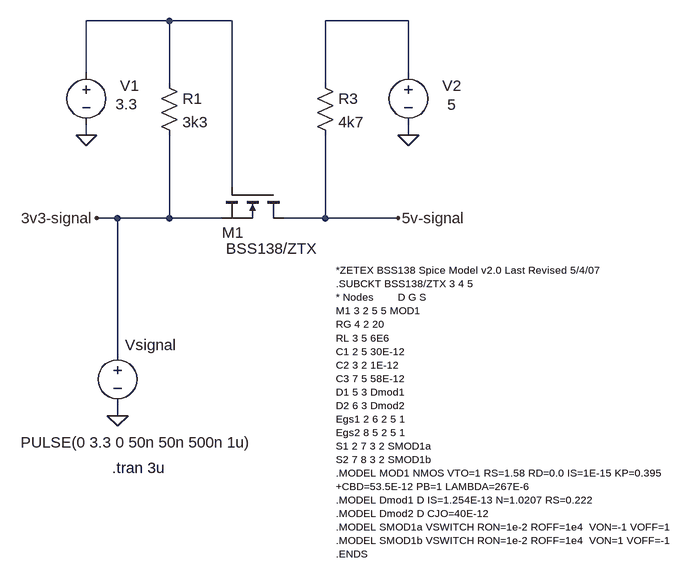
[diagram p0: schematic LTSPICE logic level shifter.asc]
LTSPICE logic level shifter.asc, the LTspice schematic file:
Version 4.1
SHEET 1 1396 740
WIRE 288 -96 160 -96
WIRE 384 -96 288 -96
WIRE 656 -96 528 -96
WIRE 160 -16 160 -96
WIRE 656 -16 656 -96
WIRE 288 0 288 -96
WIRE 528 0 528 -96
WIRE 160 80 160 64
WIRE 656 80 656 64
WIRE 384 160 384 -96
WIRE 208 208 176 208
WIRE 288 208 288 80
WIRE 288 208 208 208
WIRE 368 208 288 208
WIRE 528 208 528 80
WIRE 528 208 464 208
WIRE 640 208 528 208
WIRE 208 416 208 208
WIRE 208 512 208 496
FLAG 208 512 0
FLAG 160 80 0
FLAG 656 80 0
FLAG 176 208 3v3-signal
FLAG 640 208 5v-signal
SYMBOL voltage 160 -32 R0
WINDOW 3 45 64 Left 2
WINDOW 123 0 0 Left 0
WINDOW 39 0 0 Left 0
WINDOW 0 52 36 Left 2
SYMATTR Value 3.3
SYMATTR InstName V1
SYMBOL voltage 656 -32 R0
WINDOW 3 60 65 Left 2
WINDOW 123 0 0 Left 0
WINDOW 39 0 0 Left 0
WINDOW 0 52 36 Left 2
SYMATTR Value 5
SYMATTR InstName V2
SYMBOL voltage 208 400 R0
WINDOW 3 -149 153 Left 2
WINDOW 123 0 0 Left 0
WINDOW 39 0 0 Left 0
WINDOW 0 12 3 Left 2
SYMATTR Value PULSE(0 3.3 0 50n 50n 500n 1u)
SYMATTR InstName Vsignal
SYMBOL nmos 464 160 R90
WINDOW 0 70 61 VRight 2
WINDOW 3 95 -51 VRight 2
SYMATTR InstName M1
SYMATTR Value BSS138/ZTX
SYMATTR Prefix X
SYMBOL res 272 -16 R0
SYMATTR InstName R1
SYMATTR Value 3k3
SYMBOL res 512 -16 R0
SYMATTR InstName R3
SYMATTR Value 4k7
TEXT 200 592 Left 2 !.tran 3u
TEXT 544 288 Left 1 !*ZETEX BSS138 Spice Model v2.0 Last Revised 5/4/07\n.SUBCKT BSS138/ZTX 3 4 5\n* Nodes        D G S\nM1 3 2 5 5 MOD1\nRG 4 2 20\nRL 3 5 6E6\nC1 2 5 30E-12\nC2 3 2 1E-12 \nC3 7 5 58E-12\nD1 5 3 Dmod1\nD2 6 3 Dmod2\nEgs1 2 6 2 5 1\nEgs2 8 5 2 5 1\nS1 2 7 3 2 SMOD1a\nS2 7 8 3 2 SMOD1b\n.MODEL MOD1 NMOS VTO=1 RS=1.58 RD=0.0 IS=1E-15 KP=0.395\n+CBD=53.5E-12 PB=1 LAMBDA=267E-6\n.MODEL Dmod1 D IS=1.254E-13 N=1.0207 RS=0.222\n.MODEL Dmod2 D CJO=40E-12\n.MODEL SMOD1a VSWITCH RON=1e-2 ROFF=1e4  VON=-1 VOFF=1\n.MODEL SMOD1b VSWITCH RON=1e-2 ROFF=1e4  VON=1 VOFF=-1\n.ENDS

The netlist it stands for:
* LTSPICE logic level shifter.asc
V1 N001 0 3.3
V2 N002 0 5
Vsignal 3v3-signal 0 PULSE(0 3.3 0 50n 50n 500n 1u)
X§M1 5v-signal N001 3v3-signal BSS138/ZTX  ; pins D G S
R1 N001 3v3-signal 3k3
R3 N002 5v-signal 4k7
.tran 3u
*ZETEX BSS138 Spice Model v2.0 Last Revised 5/4/07
.SUBCKT BSS138/ZTX 3 4 5
* Nodes        D G S
M1 3 2 5 5 MOD1
RG 4 2 20
RL 3 5 6E6
C1 2 5 30E-12
C2 3 2 1E-12
C3 7 5 58E-12
D1 5 3 Dmod1
D2 6 3 Dmod2
Egs1 2 6 2 5 1
Egs2 8 5 2 5 1
S1 2 7 3 2 SMOD1a
S2 7 8 3 2 SMOD1b
.MODEL MOD1 NMOS VTO=1 RS=1.58 RD=0.0 IS=1E-15 KP=0.395
+CBD=53.5E-12 PB=1 LAMBDA=267E-6
.MODEL Dmod1 D IS=1.254E-13 N=1.0207 RS=0.222
.MODEL Dmod2 D CJO=40E-12
.MODEL SMOD1a VSWITCH RON=1e-2 ROFF=1e4  VON=-1 VOFF=1
.MODEL SMOD1b VSWITCH RON=1e-2 ROFF=1e4  VON=1 VOFF=-1
.ENDS
.backanno
.end